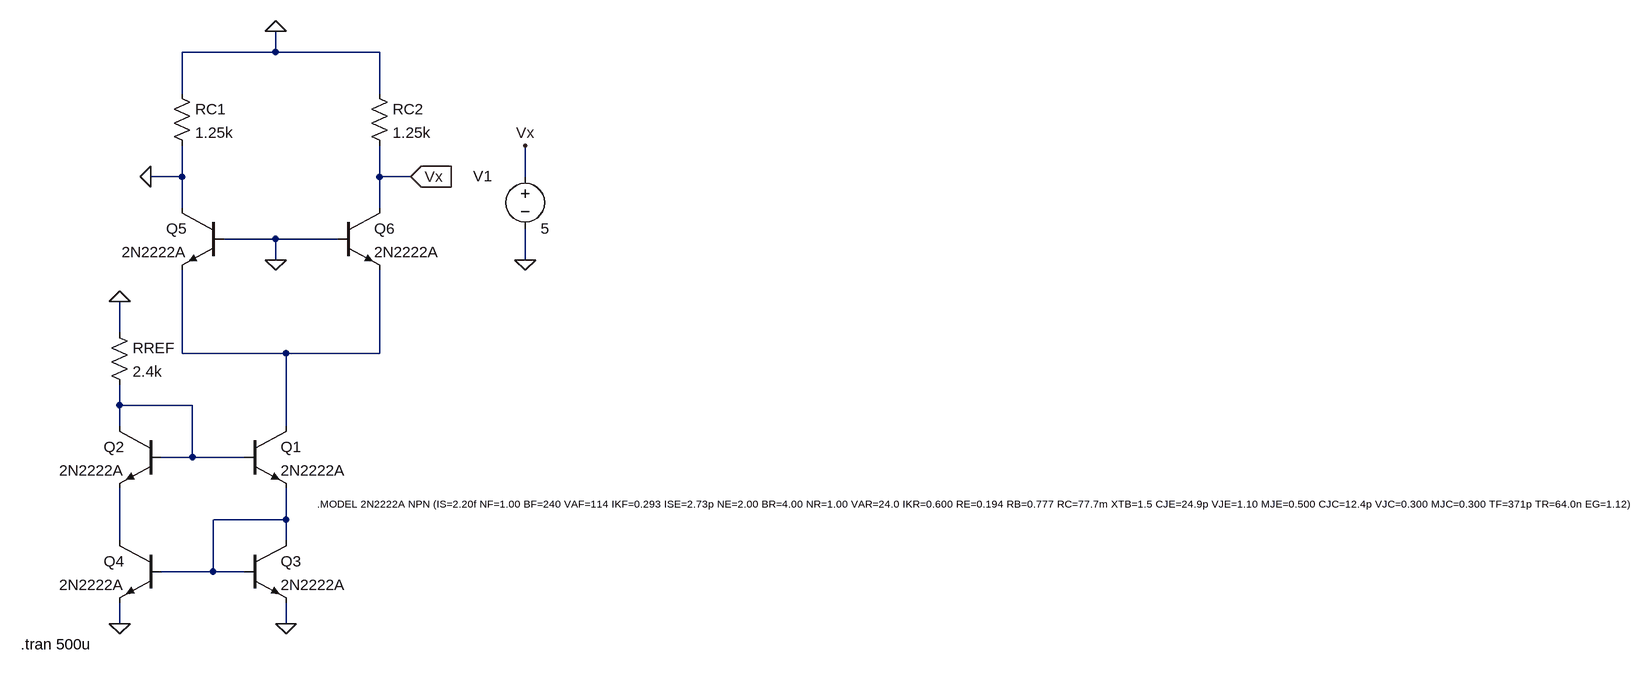
[diagram p0: schematic DiffAmp_Currsrc_OutputResis.asc]
DiffAmp_Currsrc_OutputResis.asc, the LTspice schematic file:
Version 4
SHEET 1 2688 760
WIRE 464 -224 464 -256
WIRE 464 -224 320 -224
WIRE 624 -224 464 -224
WIRE 320 -160 320 -224
WIRE 624 -160 624 -224
WIRE 320 -32 320 -80
WIRE 320 -32 272 -32
WIRE 624 -32 624 -80
WIRE 672 -32 624 -32
WIRE 848 -32 848 -80
WIRE 320 16 320 -32
WIRE 624 16 624 -32
WIRE 464 64 384 64
WIRE 560 64 464 64
WIRE 464 96 464 64
WIRE 848 96 848 48
WIRE 224 208 224 160
WIRE 320 240 320 112
WIRE 480 240 320 240
WIRE 624 240 624 112
WIRE 624 240 480 240
WIRE 224 320 224 288
WIRE 336 320 224 320
WIRE 224 352 224 320
WIRE 480 352 480 240
WIRE 336 400 336 320
WIRE 336 400 288 400
WIRE 416 400 336 400
WIRE 480 496 480 448
WIRE 480 496 368 496
WIRE 224 528 224 448
WIRE 480 528 480 496
WIRE 368 576 368 496
WIRE 368 576 288 576
WIRE 416 576 368 576
WIRE 224 656 224 624
WIRE 480 656 480 624
FLAG 848 96 0
FLAG 848 -80 Vx
FLAG 224 160 0
FLAG 224 656 0
FLAG 480 656 0
FLAG 672 -32 Vx
IOPIN 672 -32 In
FLAG 272 -32 0
FLAG 464 -256 0
FLAG 464 96 0
SYMBOL npn 416 352 R0
SYMATTR InstName Q1
SYMATTR Value 2N2222A
SYMBOL npn 288 352 M0
SYMATTR InstName Q2
SYMATTR Value 2N2222A
SYMBOL voltage 848 -48 R0
WINDOW 0 -80 15 Left 2
SYMATTR InstName V1
SYMATTR Value 5
SYMBOL res 208 192 R0
SYMATTR InstName RREF
SYMATTR Value 2.4k
SYMBOL npn 416 528 R0
SYMATTR InstName Q3
SYMATTR Value 2N2222A
SYMBOL npn 288 528 M0
SYMATTR InstName Q4
SYMATTR Value 2N2222A
SYMBOL res 304 -176 R0
SYMATTR InstName RC1
SYMATTR Value 1.25k
SYMBOL res 608 -176 R0
SYMATTR InstName RC2
SYMATTR Value 1.25k
SYMBOL npn 384 16 M0
SYMATTR InstName Q5
SYMATTR Value 2N2222A
SYMBOL npn 560 16 R0
SYMATTR InstName Q6
SYMATTR Value 2N2222A
TEXT 528 472 Left 1 !.MODEL 2N2222A NPN (IS=2.20f NF=1.00 BF=240 VAF=114 IKF=0.293 ISE=2.73p NE=2.00 BR=4.00 NR=1.00 VAR=24.0 IKR=0.600 RE=0.194 RB=0.777 RC=77.7m XTB=1.5 CJE=24.9p VJE=1.10 MJE=0.500 CJC=12.4p VJC=0.300 MJC=0.300 TF=371p TR=64.0n EG=1.12)
TEXT 72 688 Left 2 !.tran 500u

The netlist it stands for:
* DiffAmp_Currsrc_OutputResis.asc
Q1 N001 N002 N003 0 2N2222A
Q2 N002 N002 N004 0 2N2222A
V1 Vx 0 5
RREF 0 N002 2.4k
Q3 N003 N003 0 0 2N2222A
Q4 N004 N003 0 0 2N2222A
RC1 0 0 1.25k
RC2 0 Vx 1.25k
Q5 0 0 N001 0 2N2222A
Q6 Vx 0 N001 0 2N2222A
.model NPN NPN
.model PNP PNP
.lib standard.bjt
.MODEL 2N2222A NPN (IS=2.20f NF=1.00 BF=240 VAF=114 IKF=0.293 ISE=2.73p NE=2.00 BR=4.00 NR=1.00 VAR=24.0 IKR=0.600 RE=0.194 RB=0.777 RC=77.7m XTB=1.5 CJE=24.9p VJE=1.10 MJE=0.500 CJC=12.4p VJC=0.300 MJC=0.300 TF=371p TR=64.0n EG=1.12)
.tran 500u
.backanno
.end